# Altium schematic sheet VCA_2.SchDoc
size A3
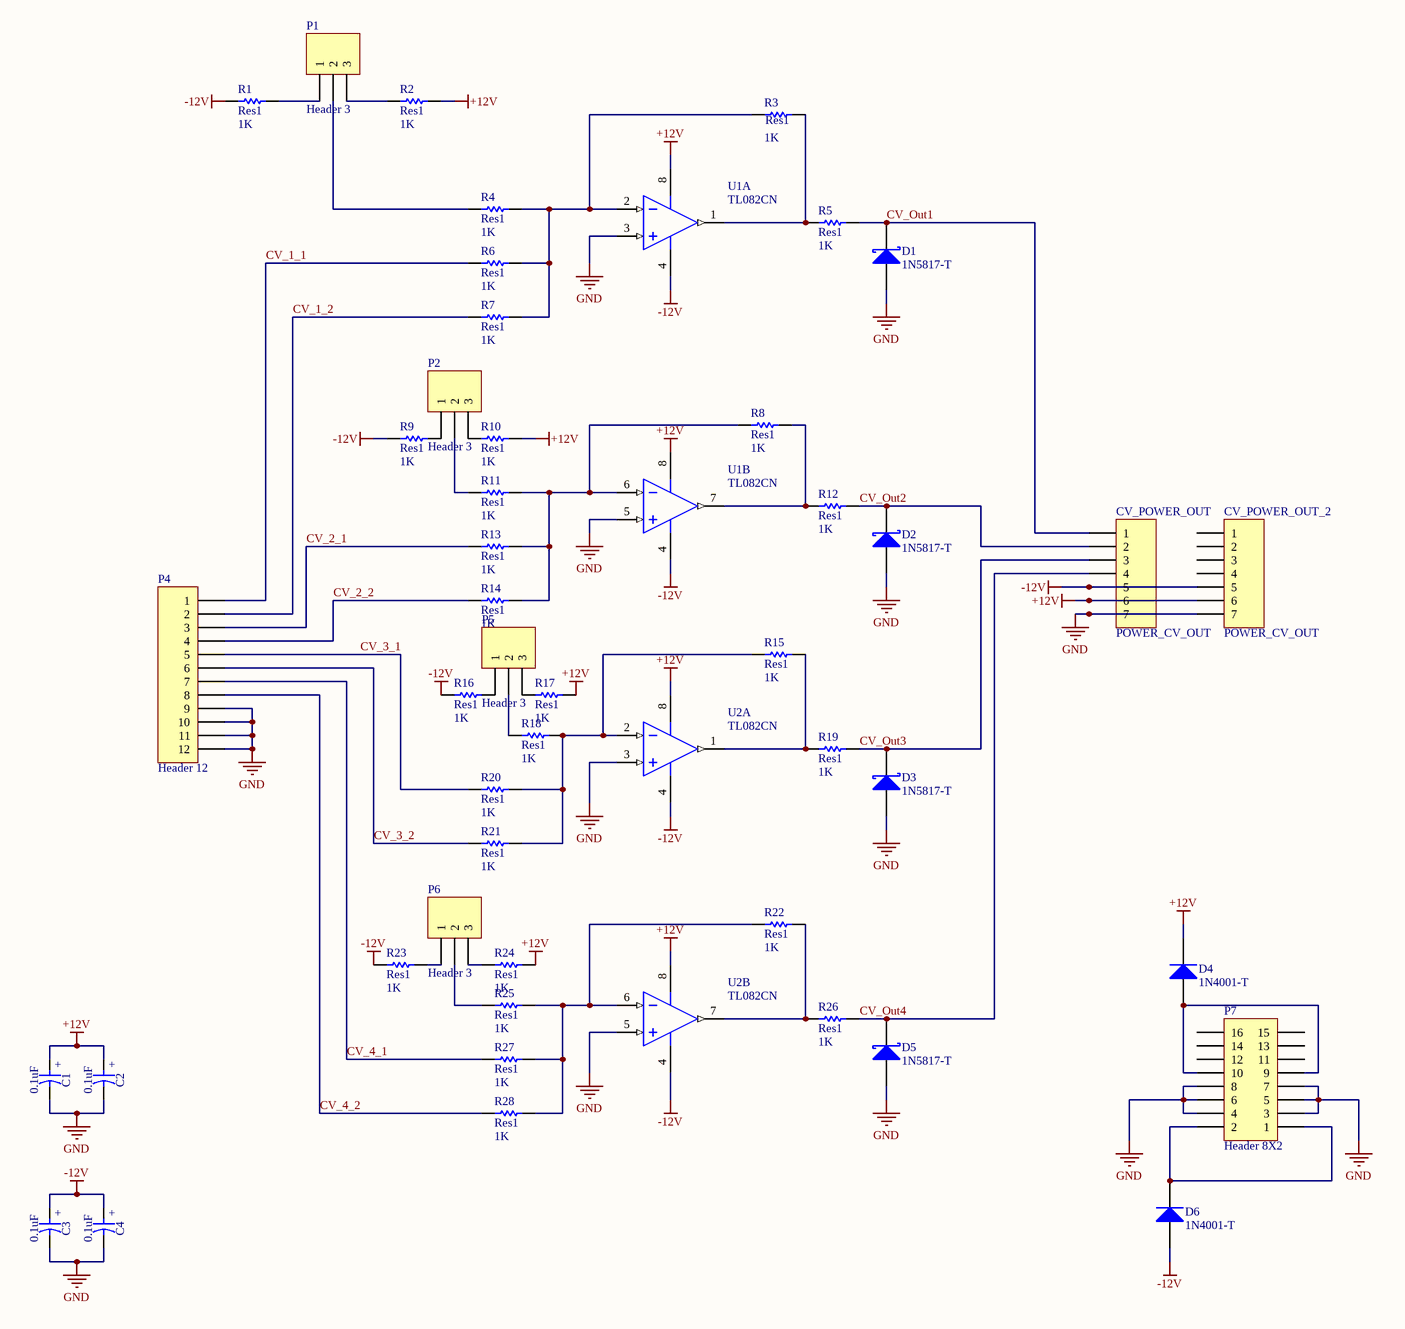
[diagram p0: VCA_2.SchDoc]

## Parts
C1  0.1uF  [CAPPRB508-450x850]
C2  0.1uF  [CAPPRB508-450x850]
C3  0.1uF  [CAPPRB508-450x850]
C4  0.1uF  [CAPPRB508-450x850]
CV_POWER_OUT  POWER_CV_OUT  [HDR1X7]
CV_POWER_OUT_2  POWER_CV_OUT  [HDR1X7]
D1  1N5817-T  [DIOD-DO-41-P-2]
D2  1N5817-T  [DIOD-DO-41-P-2]
D3  1N5817-T  [DIOD-DO-41-P-2]
D4  1N4001-T  [DIOD-DO-41-P-2_V]
D5  1N5817-T  [DIOD-DO-41-P-2]
D6  1N4001-T  [DIOD-DO-41-P-2_V]
P1  Header 3  [HDR1X3]
P2  Header 3  [HDR1X3]
P4  Header 12  [HDR1X12]
P5  Header 3  [HDR1X3]
P6  Header 3  [HDR1X3]
P7  Header 8X2  [HDR2X8]
R1  Res1  value 1K  [AXIAL-0.3]
R2  Res1  value 1K  [AXIAL-0.3]
R3  Res1  value 1K  [AXIAL-0.3]
R4  Res1  value 1K  [AXIAL-0.3]
R5  Res1  value 1K  [AXIAL-0.3]
R6  Res1  value 1K  [AXIAL-0.3]
R7  Res1  value 1K  [AXIAL-0.3]
R8  Res1  value 1K  [AXIAL-0.3]
R9  Res1  value 1K  [AXIAL-0.3]
R10  Res1  value 1K  [AXIAL-0.3]
R11  Res1  value 1K  [AXIAL-0.3]
R12  Res1  value 1K  [AXIAL-0.3]
R13  Res1  value 1K  [AXIAL-0.3]
R14  Res1  value 1K  [AXIAL-0.3]
R15  Res1  value 1K  [AXIAL-0.3]
R16  Res1  value 1K  [AXIAL-0.3]
R17  Res1  value 1K  [AXIAL-0.3]
R18  Res1  value 1K  [AXIAL-0.3]
R19  Res1  value 1K  [AXIAL-0.3]
R20  Res1  value 1K  [AXIAL-0.3]
R21  Res1  value 1K  [AXIAL-0.3]
R22  Res1  value 1K  [AXIAL-0.3]
R23  Res1  value 1K  [AXIAL-0.3]
R24  Res1  value 1K  [AXIAL-0.3]
R25  Res1  value 1K  [AXIAL-0.3]
R26  Res1  value 1K  [AXIAL-0.3]
R27  Res1  value 1K  [AXIAL-0.3]
R28  Res1  value 1K  [AXIAL-0.3]
U1  TL082CN  [STM-N8]  (parts A,B of 2)
U2  TL082CN  [STM-N8]  (parts A,B of 2)

## Nets
+12V: C1.1 C2.1 CV_POWER_OUT.6 CV_POWER_OUT_2.6 D4.2(K) R2.2 R10.2 R17.2 R24.2 U1.8(VCC+) U2.8(VCC+)
-12V: C3.1 C4.1 CV_POWER_OUT.5 CV_POWER_OUT_2.5 D6.1(A) R1.1 R9.1 R16.1 R23.1 U1.4(VCC-) U2.4(VCC-)
GND: C1.2 C2.2 C3.2 C4.2 CV_POWER_OUT.7 CV_POWER_OUT_2.7 D1.1(A) D2.1(A) D3.1(A) D5.1(A) P4.9 P4.10 P4.11 P4.12 P7.3 P7.4 P7.5 P7.6 P7.7 P7.8 U1.3(IN1+) U1.5(IN2+) U2.3(IN1+) U2.5(IN2+)
CV_1_1: P4.1 R6.1
CV_1_2: P4.2 R7.1
CV_2_1: P4.3 R13.1
CV_2_2: P4.4 R14.1
CV_3_1: P4.5 R20.1
CV_3_2: P4.6 R21.1
CV_4_1: P4.7 R27.1
CV_4_2: P4.8 R28.1
CV_Out1: CV_POWER_OUT.1 D1.2(K) R5.2
CV_Out2: CV_POWER_OUT.2 D2.2(K) R12.2
CV_Out3: CV_POWER_OUT.3 D3.2(K) R19.2
CV_Out4: CV_POWER_OUT.4 D5.2(K) R26.2
NetD4_1: D4.1(A) P7.9 P7.10
NetD6_2: D6.2(K) P7.1 P7.2
NetP1_1: P1.1 R1.2
NetP1_2: P1.2 R4.1
NetP1_3: P1.3 R2.1
NetP2_1: P2.1 R9.2
NetP2_2: P2.2 R11.1
NetP2_3: P2.3 R10.1
NetP5_1: P5.1 R16.2
NetP5_2: P5.2 R18.1
NetP5_3: P5.3 R17.1
NetP6_1: P6.1 R23.2
NetP6_2: P6.2 R25.1
NetP6_3: P6.3 R24.1
NetR3_1: R3.1 R4.2 R6.2 R7.2 U1.2(IN1-)
NetR3_2: R3.2 R5.1 U1.1(OUT1)
NetR8_1: R8.1 R11.2 R13.2 R14.2 U1.6(IN2-)
NetR8_2: R8.2 R12.1 U1.7(OUT2)
NetR15_1: R15.1 R18.2 R20.2 R21.2 U2.2(IN1-)
NetR15_2: R15.2 R19.1 U2.1(OUT1)
NetR22_1: R22.1 R25.2 R27.2 R28.2 U2.6(IN2-)
NetR22_2: R22.2 R26.1 U2.7(OUT2)

Not connected (* = marked no-connect by the designer): CV_POWER_OUT_2 1 2 3 4; P7 11 12 13 14 15 16

## Notes on the sheet
- (in symbol CTEB_0.1UF_35V_10%_508-450X850) +

## Library data of the parts
C1-C4 = CTEB_0.1UF_35V_10%_508-450X850: Polarised capacitor; Part Description: Solid Tantalum Resin Dipped Capacitor; Manufacturer: AVX; Manufacturer Part Number: TAP104M035CCS-LF; Voltage: 35V; Tolerance: ±10%; Part Number: CTEB_0.1UF_35V_10%_508-450X850; Component Kind: Standard; Component Type: Standard; Pin Count: 2; Value: 0.1uF; Status: None; Case: LS5.08 D4.5 x H8.5; Mounted: Yes; Socket: No; SMD: No; Sense: No; ComponentHeight: 8.5mm; HelpURL: \\cern.ch\dfs\Applications\Altium\Datasheets\CTEB_AVX_TAP.pdf; Author: CERN DEM JLC; CreateDate: 19/08/2010; LatestRevisionDate: 19/08/2010
CV_POWER_OUT = Header 7: Header, 7-Pin; System: Connector; LatestRevisionDate: 17-Jul-2002; LatestRevisionNote: Re-released for DXP Platform.; Publisher: Altium Limited
CV_POWER_OUT_2 = Header 7: Header, 7-Pin; LatestRevisionDate: 17-Jul-2002; LatestRevisionNote: Re-released for DXP Platform.; Publisher: Altium Limited
D1-D3 D5 = CMP-2000-05521-1: Schottky Barrier Rectifier, 1 A, 20 V, -65 to 125 degC, 2-Pin DO-41, RoHS, Tape and Reel; Manufacturer: DiodesIncorporated; Vrrm - Repetitive Reverse Voltage: 20V; If - Forward Current: 1A; Configuration: Single; Unit Weight: 0.010582oz; Type: SchottkyDiode; Ifsm - Forward Surge Current: 25A; Vf - Forward Voltage: 0.75Vat3A; Ir - Reverse Current: 1000uA; Technology: Si; Length: 5.21mm; Product: SchottkyRectifiers; Package Reference: DO-41-P-2; Package / Case: DO-41; Datasheet URL: http://www.diodes.com/_files/datasheets/ds23001.pdf; Operating Temperature Range: -65Cto+125C; Mounting Style: ThroughHole; Manufacturer URL: http://www.diodes.com/; Series: 1N58; Minimum Operating Temperature: -65C; Height: 2.72mm; Brand: DiodesIncorporated; Maximum Operating Temperature: +125C; Datasheet Version: Rev. 8-2, 05/2009; Factory Pack Quantity: 5000; Width: 2.72mm; RoHS: True; Product Category: SchottkyDiodes&Rectifiers; Package Description: 2-Pin Through Hole Device, Body 4.635 x 2.36 mm, Pin Spacing 7.85 mm; Packaging: Reel; Termination Style: ThroughHole; Mounting Technology: ThroughHole
D4 D6 = CMP-0639-00006-1: 1.0 A Rectifier, 15 pF, 50 V, -65 to 150 degC, 2-Pin DO-41 Plastic, RoHS, Tape and Reel; Manufacturer: Diodes Inc; Max. IR (uA): 5; CT (pF): 15; Max. Average Rectified Current IO (A): 1; VRRM (V): 50; Max. IFSM (A): 30; PartNumber: 1N4001-T; PackageReference: DO-41-P-2; RoHS: TRUE; Operating Temperature Range (degC): -65 to 150; Mounting Technology: Through Hole; VF (V): 1; PackageDescription: 2-Pin Axial Lead, Body 4.635 x 2.36 mm, Lead Spread 25.4 mm; ComponentLink2URL: http://diodes.com/datasheets/ds28002.pdf; Packing: Tape and Reel; DatasheetVersion: Rev. 8-2; ComponentLink2Description: Datasheet; ComponentLink1Description: Manufacturer URL; ComponentLink1URL: http://diodes.com/
P1 P2 P5 P6 = Header 3: Header, 3-Pin; LatestRevisionDate: 17-Jul-2002; LatestRevisionNote: Re-released for DXP Platform.; Publisher: Altium Limited
P4 = Header 12: Header, 12-Pin; LatestRevisionDate: 17-Jul-2002; LatestRevisionNote: Re-released for DXP Platform.; Publisher: Altium Limited
P7 = Header 8X2: Header, 8-Pin, Dual row; LatestRevisionDate: 17-Jul-2002; LatestRevisionNote: Re-released for DXP Platform.; Publisher: Altium Limited
R1-R28 = Res1: Resistor; Published: 8-Jun-2000; LatestRevisionDate: 17-Jul-2002; LatestRevisionNote: Re-released for DXP Platform.; PackageReference: AXIAL-0.3; Publisher: Altium Limited; PackageDescription: Axial Device, Thru-Hole; 2 Leads; 0.3 in Pin Spacing
U1 U2 = CMP-2000-07247-1: General Purpose JFET Dual Operational Amplifier, 4 MHz, 6 to 36 V, 0 to 70 degC, 8-Pin DIP (N8), RoHS, Tube; Manufacturer: STMicroelectronics; Manufacturer Type: GeneralPurposeAmplifier; Number of Channels per Chip: 2; Typical Dual Supply Voltage: 5V; Maximum Input Offset Voltage: 10mV@15V; Typical Slew Rate: 16V/us@15V; Rail to Rail: No; Maximum Dual Supply Voltage: 18V; Minimum CMRR: 70dB; Maximum Supply Current: 2.5mA@15V; Typical Input Noise Voltage Density: 15nV/rtHz@15V; Pin_Count: 8; Minimum Dual Supply Voltage: 3V; Maximum Power Dissipation: 680mW; Product Height: 3.3mm; Typical Voltage Gain: 106.02dB; Typical Gain Bandwidth Product: 4MHz; Maximum Input Bias Current: 0.0004uA@15V; Product Length: 9.27mm; Product Width: 6.35mm; Power Supply Type: Dual; Package Description: 8-Pin Double In-line Package, Body 9.59 x 6.605 mm, Pitch 2.54 mm; Datasheet Version: Rev. 10, 06/2008; Shut Down Support: No; Package Reference: N8; Mounting Technology: ThroughHole; Maximum Operating Temperature: 70C; Type: GeneralPurposeAmplifier; Manufacturer URL: http://www.st.com/; Mounting: ThroughHole; Minimum Operating Temperature: 0C; Supplier_Package: PDIP; Family: TL082; Technology: BiFET; Product Type: OPAmp; Packaging: Tube; Datasheet URL: https://datasheet.ciiva.com/19471/2002077-19471009.pdf; PartId: 1